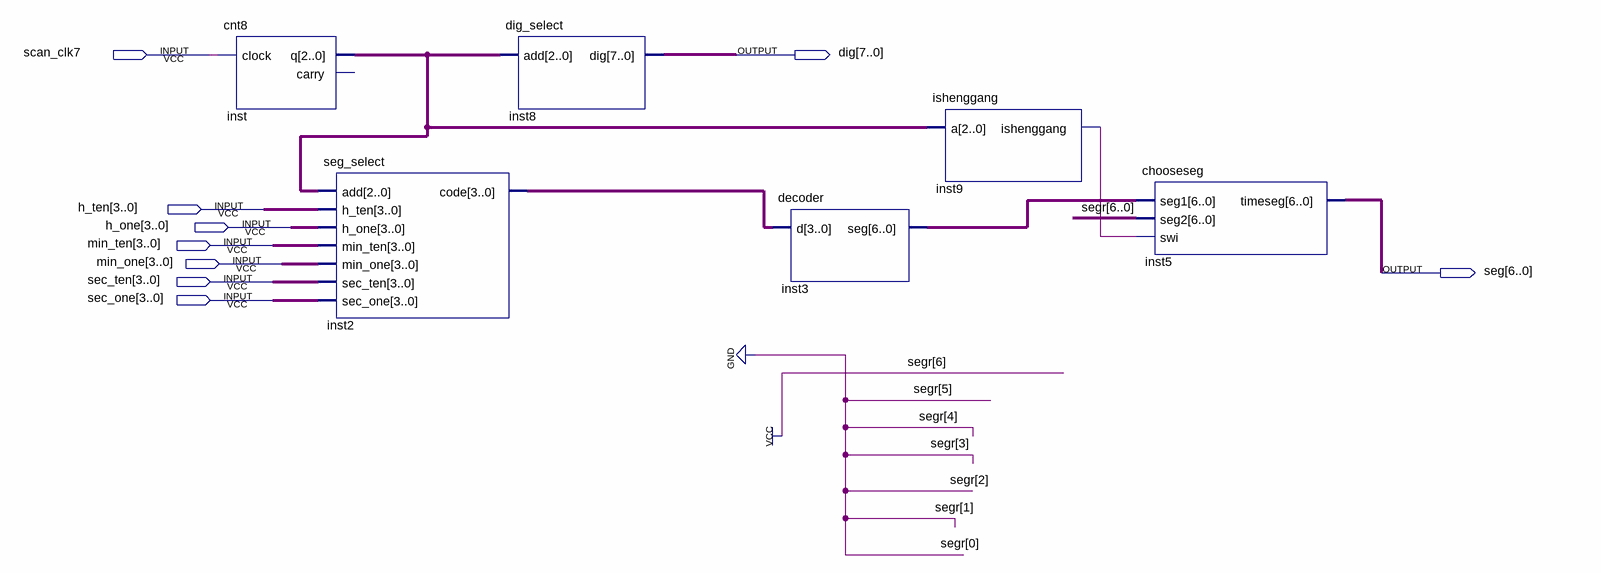
[diagram p0: schematic sheet]
// Quartus schematic display.bdf as structural Verilog: 6 symbols, 9 pins
module display (
  input  scan_clk7,
  input  [3:0] h_ten,
  input  [3:0] h_one,
  input  [3:0] min_ten,
  input  [3:0] min_one,
  input  [3:0] sec_ten,
  input  [3:0] sec_one,
  output [7:0] dig,
  output [6:0] seg
);

  wire inst9_ishenggang;
  wire [2:0] inst_q;
  wire [3:0] inst2_code;
  wire [6:0] inst3_seg;

  cnt8 inst (.clock(scan_clk7), .q(inst_q));  // open: carry
  seg_select inst2 (
    .add(inst_q), .h_ten(h_ten), .h_one(h_one), .min_ten(min_ten), .min_one(min_one), .sec_ten(sec_ten),
    .sec_one(sec_one), .code(inst2_code));
  dig_select inst8 (.add(inst_q), .dig(dig));
  decoder inst3 (.d(inst2_code), .seg(inst3_seg));
  ishenggang inst9 (.a(inst_q), .ishenggang(inst9_ishenggang));
  chooseseg inst5 (.seg1(inst3_seg), .seg2(7'b1000000), .swi(inst9_ishenggang), .timeseg(seg));
endmodule
